# Altium schematic sheet Analog Inputs.SchDoc
size A4; Author: Thomas Kreppel; CompanyName: Universidad de Santiago de Chile; Address1: Avenida Ecuador Nº 3519; Address2: Estación Central, Santiago; Address3: Chile; DocumentNumber: 4; SheetNumber: 4; SheetTotal: 10
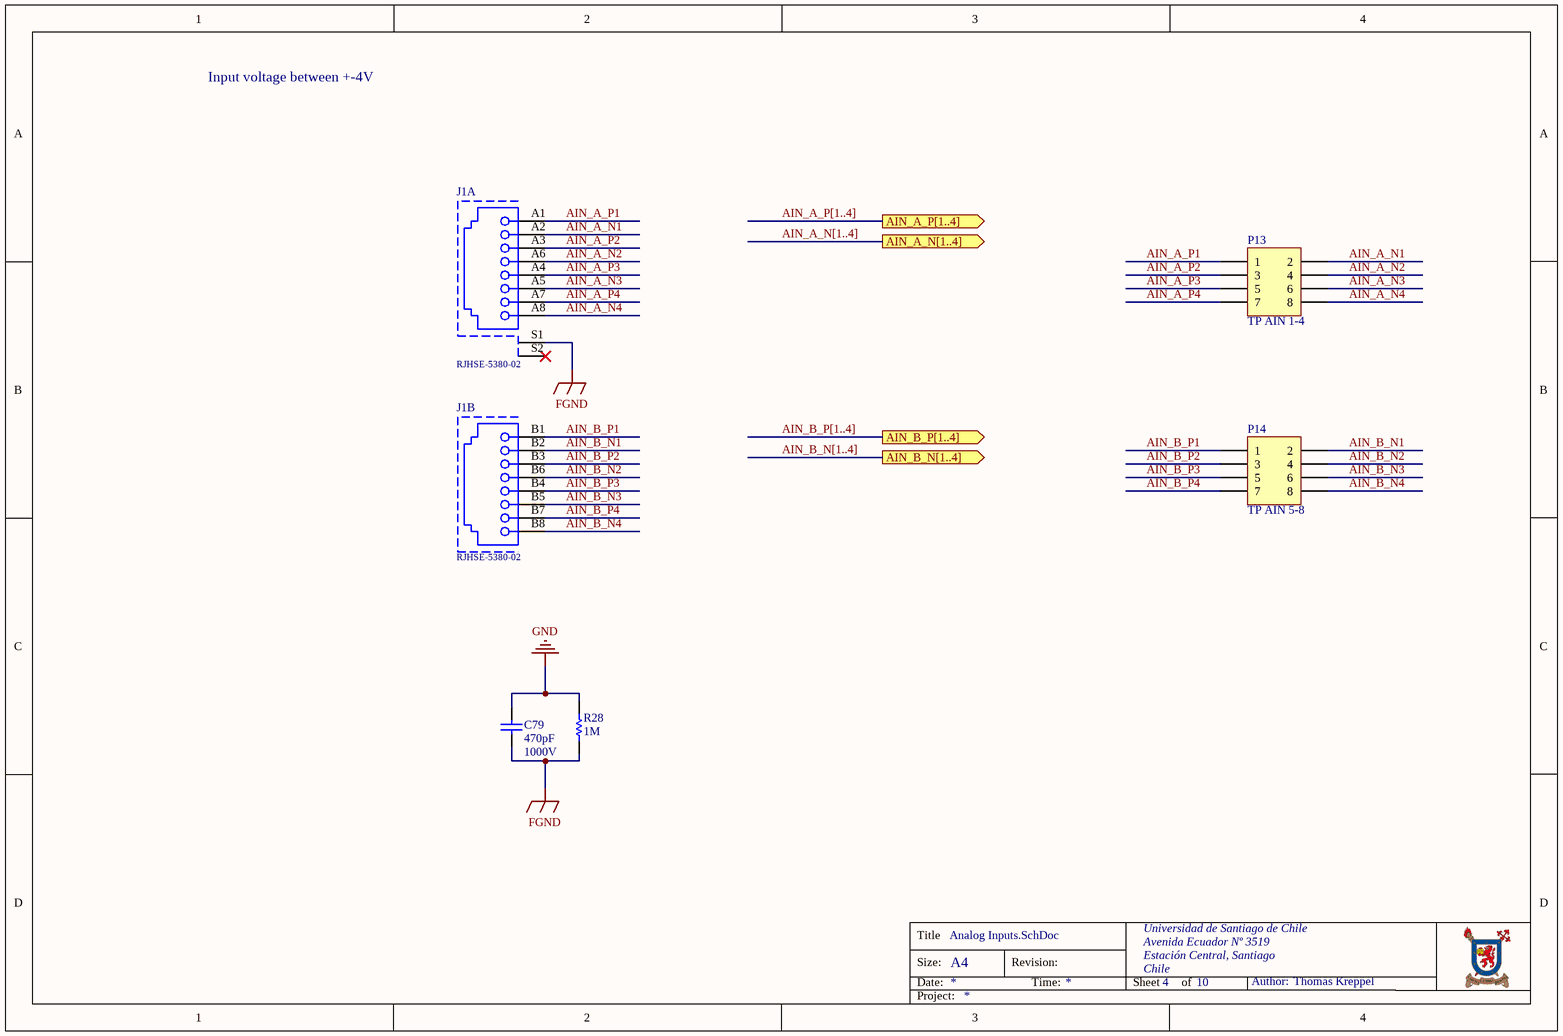
[diagram p0: Analog Inputs.SchDoc]

## Parts
C79  470pF  Voltage: 1000V  [RES_1206]
J1  RJHSE-5380-02  [RJHSE-5380-02]  (parts A,B of 2)
P13  TP AIN 1-4  [HDR2X4]  (no BOM)
P14  TP AIN 5-8  [HDR2X4]  (no BOM)
R28  1M  [RES_1206]

## Ports
AIN_A_N[1..4] (out), AIN_A_P[1..4] (out), AIN_B_N[1..4] (out), AIN_B_P[1..4] (out)

## Nets
FGND: C79.2 J1.S1 R28.1
GND: C79.1 R28.2
AIN_A_N1: J1.A2 P13.2
AIN_A_N2: J1.A6 P13.4
AIN_A_N3: J1.A5 P13.6
AIN_A_N4: J1.A8 P13.8
AIN_A_P1: J1.A1 P13.1
AIN_A_P2: J1.A3 P13.3
AIN_A_P3: J1.A4 P13.5
AIN_A_P4: J1.A7 P13.7
AIN_B_N1: J1.B2 P14.2
AIN_B_N2: J1.B6 P14.4
AIN_B_N3: J1.B5 P14.6
AIN_B_N4: J1.B8 P14.8
AIN_B_P1: J1.B1 P14.1
AIN_B_P2: J1.B3 P14.3
AIN_B_P3: J1.B4 P14.5
AIN_B_P4: J1.B7 P14.7

Not connected (* = marked no-connect by the designer): J1 S2*

## Buses and harness runs
bus AIN_A_N[1..4] = port AIN_A_N[1..4]
bus AIN_A_P[1..4] = port AIN_A_P[1..4]
bus AIN_B_N[1..4] = port AIN_B_N[1..4]
bus AIN_B_P[1..4] = port AIN_B_P[1..4]

## Notes on the sheet
- Input voltage between +-4V
- Title
- Size:
- Date:
- A4
- Revision:
- Time:
- Sheet
- of
- Author:
- Project:

## Library data of the parts
C79 = Cap_1206: Capacitor; MPN: 885342208017; MF: Würth Elektronik; Dielectricum: X7R; Tolerance: 10%; Supplier Part Number 1: 732-12097-1-ND; Value: 470pF; Supplier 1: Digikey; Package: 1206
J1 = RJHSE-5380-02: Modular Jack WR-MJ, Tab Up, Shielded, Dual Port, Righ Angle, THT, 8P8C; Manufacturer: Amphenol; Port: 1x2; Entrance: Right Angle; Compliance: Lead free / RoHS; Rated Current: 1.5 A; Working Voltage: 120 VAC; Withstanding Voltage: 1000 VAC; Contact Resistance: 20 mOhm; ComponentLink1Description: Manufacturer; ComponentLink1URL: http://www.we-online.de; ComponentLink2Description: Datasheet; ComponentLink2URL: https://katalog.we-online.de/em/datasheet/615016137621.pdf; Published Date: July 2018; Pin Number: 8P8C; Operating Temperature: -40 to 85 degC; Mounting Technology: THT; Packaging: Tray; Supplier 1: Digikey; Supplier Part Number 1: RJHSE-5380-02-ND; Supplier 2: Mouser; Manufacturer Part-Number: RJHSE-5380-02; Supplier Part Number 2: 523-RJHSE-5380-02
P13 P14 = Header 4X2: Header, 4-Pin, Dual row; LatestRevisionDate: 17-Jul-2002; LatestRevisionNote: Re-released for DXP Platform.; Publisher: Altium Limited
R28 = Res1206: Resistor; Manufacturer Part-Number: CRCW12101M00JNEA; Tolerance: 1%; Value: 1M; Supplier 2: Mouser; Supplier 1: Digikey; Supplier Part Number 1: 541-1.0MVCT-ND; Package: 1206